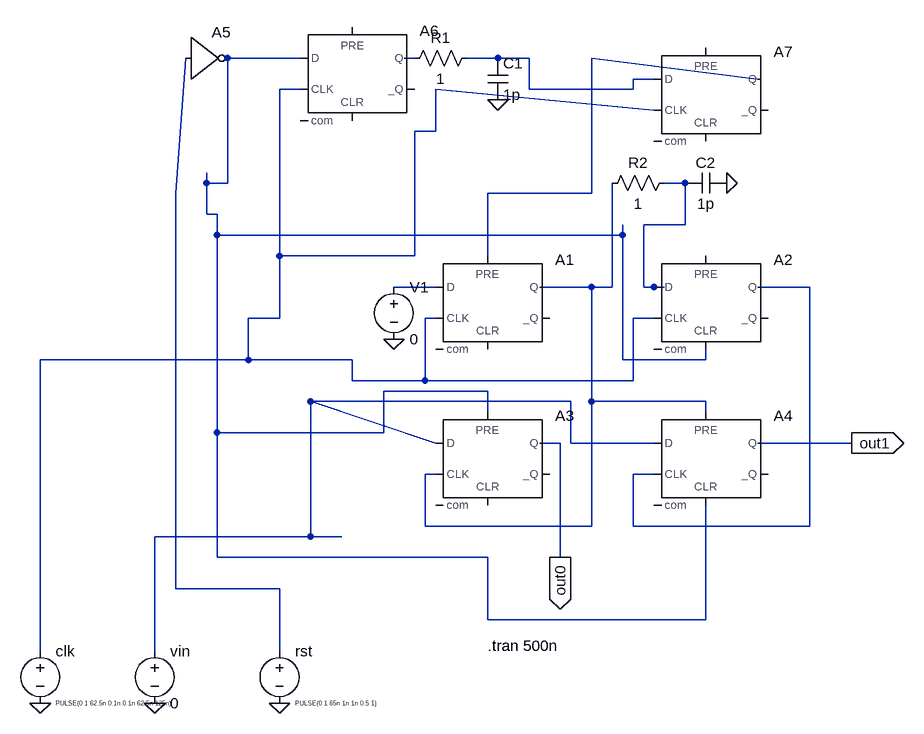
[diagram p0: schematic Draft6.asc]
Draft6.asc, the LTspice schematic file:
Version 4
SHEET 1 880 756
WIRE -224 -256 -336 -256
WIRE -48 -256 -64 -256
WIRE 80 -256 32 -256
WIRE 128 -256 80 -256
WIRE 320 -224 288 -224
WIRE 480 -224 224 -256
WIRE -224 -208 -256 -208
WIRE 128 -208 128 -256
WIRE 288 -208 288 -224
WIRE 288 -208 128 -208
WIRE 320 -176 -16 -208
WIRE -16 -144 -16 -208
WIRE -16 -144 -48 -144
WIRE -368 -64 -368 -80
WIRE -336 -64 -336 -256
WIRE -336 -64 -368 -64
WIRE 368 -64 336 -64
WIRE -416 -48 -400 -256
WIRE 224 -48 224 -256
WIRE 224 -48 64 -48
WIRE -368 -16 -368 -64
WIRE -352 -16 -368 -16
WIRE 368 0 368 -64
WIRE 368 0 304 0
WIRE -352 16 -352 -16
WIRE 272 16 272 0
WIRE 272 16 -352 16
WIRE -256 48 -256 -208
WIRE -48 48 -48 -144
WIRE -48 48 -256 48
WIRE 64 48 64 -48
WIRE -16 96 -80 96
WIRE 224 96 144 96
WIRE 256 96 256 -64
WIRE 256 96 224 96
WIRE 304 96 304 0
WIRE 320 96 304 96
WIRE 336 96 320 96
WIRE 560 96 480 96
WIRE -256 144 -256 48
WIRE -256 144 -304 144
WIRE -16 144 -32 144
WIRE 320 144 288 144
WIRE -304 208 -304 144
WIRE -304 208 -624 208
WIRE -144 208 -304 208
WIRE 272 208 272 16
WIRE 400 208 400 192
WIRE 400 208 272 208
WIRE -144 240 -144 208
WIRE -32 240 -32 144
WIRE -32 240 -144 240
WIRE 288 240 288 144
WIRE 288 240 -32 240
WIRE 64 256 -96 256
WIRE 192 272 -208 272
WIRE 224 272 224 96
WIRE 400 272 224 272
WIRE 64 288 64 256
WIRE 400 288 400 272
WIRE -352 320 -352 16
WIRE -96 320 -96 256
WIRE -96 320 -352 320
WIRE -16 336 -208 272
WIRE 176 336 144 336
WIRE 192 336 192 272
WIRE 320 336 192 336
WIRE 624 336 480 336
WIRE -16 384 -32 384
WIRE 320 384 288 384
WIRE -32 464 -32 384
WIRE 224 464 224 272
WIRE 224 464 -32 464
WIRE 288 464 288 384
WIRE 560 464 560 96
WIRE 560 464 288 464
WIRE -208 480 -208 272
WIRE -208 480 -448 480
WIRE -160 480 -208 480
WIRE -352 512 -352 320
WIRE 64 512 -352 512
WIRE 176 512 176 336
WIRE -416 560 -416 -48
WIRE -256 560 -416 560
WIRE 64 608 64 512
WIRE 400 608 400 432
WIRE 400 608 64 608
WIRE -624 656 -624 208
WIRE -448 656 -448 480
WIRE -256 656 -256 560
FLAG 176 512 out0
IOPIN 176 512 Out
FLAG 624 336 out1
IOPIN 624 336 Out
FLAG -624 736 0
FLAG -448 736 0
FLAG -256 736 0
FLAG 80 -192 0
FLAG -80 176 0
FLAG 432 -64 0
SYMBOL Digital\\dflop 64 48 R0
SYMATTR InstName A1
SYMBOL Digital\\dflop 400 48 R0
SYMATTR InstName A2
SYMBOL Digital\\dflop 64 288 R0
SYMATTR InstName A3
SYMBOL Digital\\dflop 400 288 R0
SYMATTR InstName A4
SYMBOL Digital\\inv -400 -320 R0
SYMATTR InstName A5
SYMBOL voltage -624 640 R0
WINDOW 3 24 96 Left 0
WINDOW 123 0 0 Left 0
WINDOW 39 0 0 Left 0
SYMATTR Value PULSE(0 1 62.5n 0.1n 0.1n 62.5n 125n)
SYMATTR InstName clk
SYMBOL voltage -448 640 R0
WINDOW 123 0 0 Left 0
WINDOW 39 0 0 Left 0
SYMATTR InstName vin
SYMATTR Value 0
SYMBOL voltage -256 640 R0
WINDOW 3 24 96 Left 0
WINDOW 123 0 0 Left 0
WINDOW 39 0 0 Left 0
SYMATTR Value PULSE(0 1 65n 1n 1n 0.5 1)
SYMATTR InstName rst
SYMBOL Digital\\dflop -144 -304 R0
SYMATTR InstName A6
SYMBOL Digital\\dflop 400 -272 R0
SYMATTR InstName A7
SYMBOL res 48 -272 R90
WINDOW 0 0 56 VBottom 2
WINDOW 3 32 56 VTop 2
SYMATTR InstName R1
SYMATTR Value 1
SYMBOL cap 64 -256 R0
SYMATTR InstName C1
SYMATTR Value 1p
SYMBOL voltage -80 80 R0
SYMATTR InstName V1
SYMATTR Value 0
SYMBOL res 352 -80 R90
WINDOW 0 0 56 VBottom 2
WINDOW 3 32 56 VTop 2
SYMATTR InstName R2
SYMATTR Value 1
SYMBOL cap 432 -80 R90
WINDOW 0 0 32 VBottom 2
WINDOW 3 32 32 VTop 2
SYMATTR InstName C2
SYMATTR Value 1p
TEXT 64 648 Left 2 !.tran 500n

The netlist it stands for:
* Draft6.asc
A1 N008 0 N005 N004 0 0 N009 0 DFLOP
A2 N006 0 N005 0 N001 0 N010 0 DFLOP
A3 N011 0 N009 N001 0 0 out0 0 DFLOP
A4 N011 0 N010 N009 N001 0 out1 0 DFLOP
A5 N007 0 0 0 0 N001 0 0 BUF
V§clk N005 0 PULSE(0 1 62.5n 0.1n 0.1n 62.5n 125n)
vin N011 0 0
V§rst N007 0 PULSE(0 1 65n 1n 1n 0.5 1)
A6 N001 0 N005 0 0 0 N002 0 DFLOP
A7 N003 0 N005 0 0 0 N004 0 DFLOP
R1 N003 N002 1
C1 N003 0 1p
V1 N008 0 0
R2 N006 N009 1
C2 0 N006 1p
.tran 500n
.backanno
.end

* Results of the author's LTspice run, read from the files saved beside the schematic
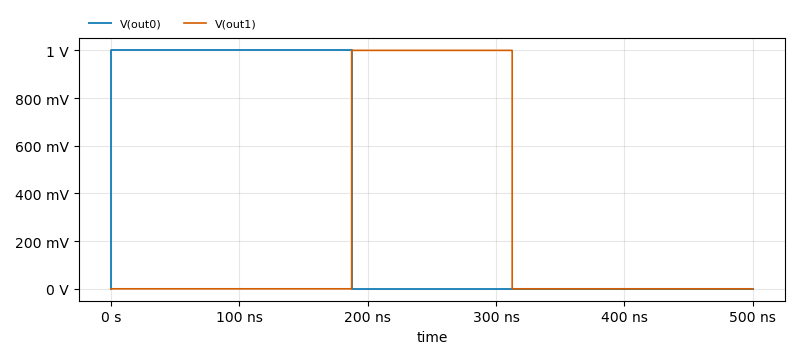
[diagram p1: Transient Analysis of Draft6.asc, plotted from the saved traces]
* Transient Analysis, 1 run:
*   V(out0): min 0 V, max 1 V, average 375.1 mV, rms 612.5 mV, last 0 V
*   V(out1): min 0 V, max 1 V, average 250 mV, rms 500 mV, last 0 V